# EasyEDA Pro project 小智ai语音聊天玩具，智能聊天，esp32-s3拓展板42pin.eprj

# Schematic Schematic1
Board Name: Schematic1; Create Date: 2025-03-19; Page Name: P1; Project Name: 小智ai语音聊天玩具，智能语音聊天，esp32-s3拓展板; Schematic Name: Schematic1; Update Date: 2025-03-21; Company: 嘉立创EDA; Page Size: A4; Version: V1.0
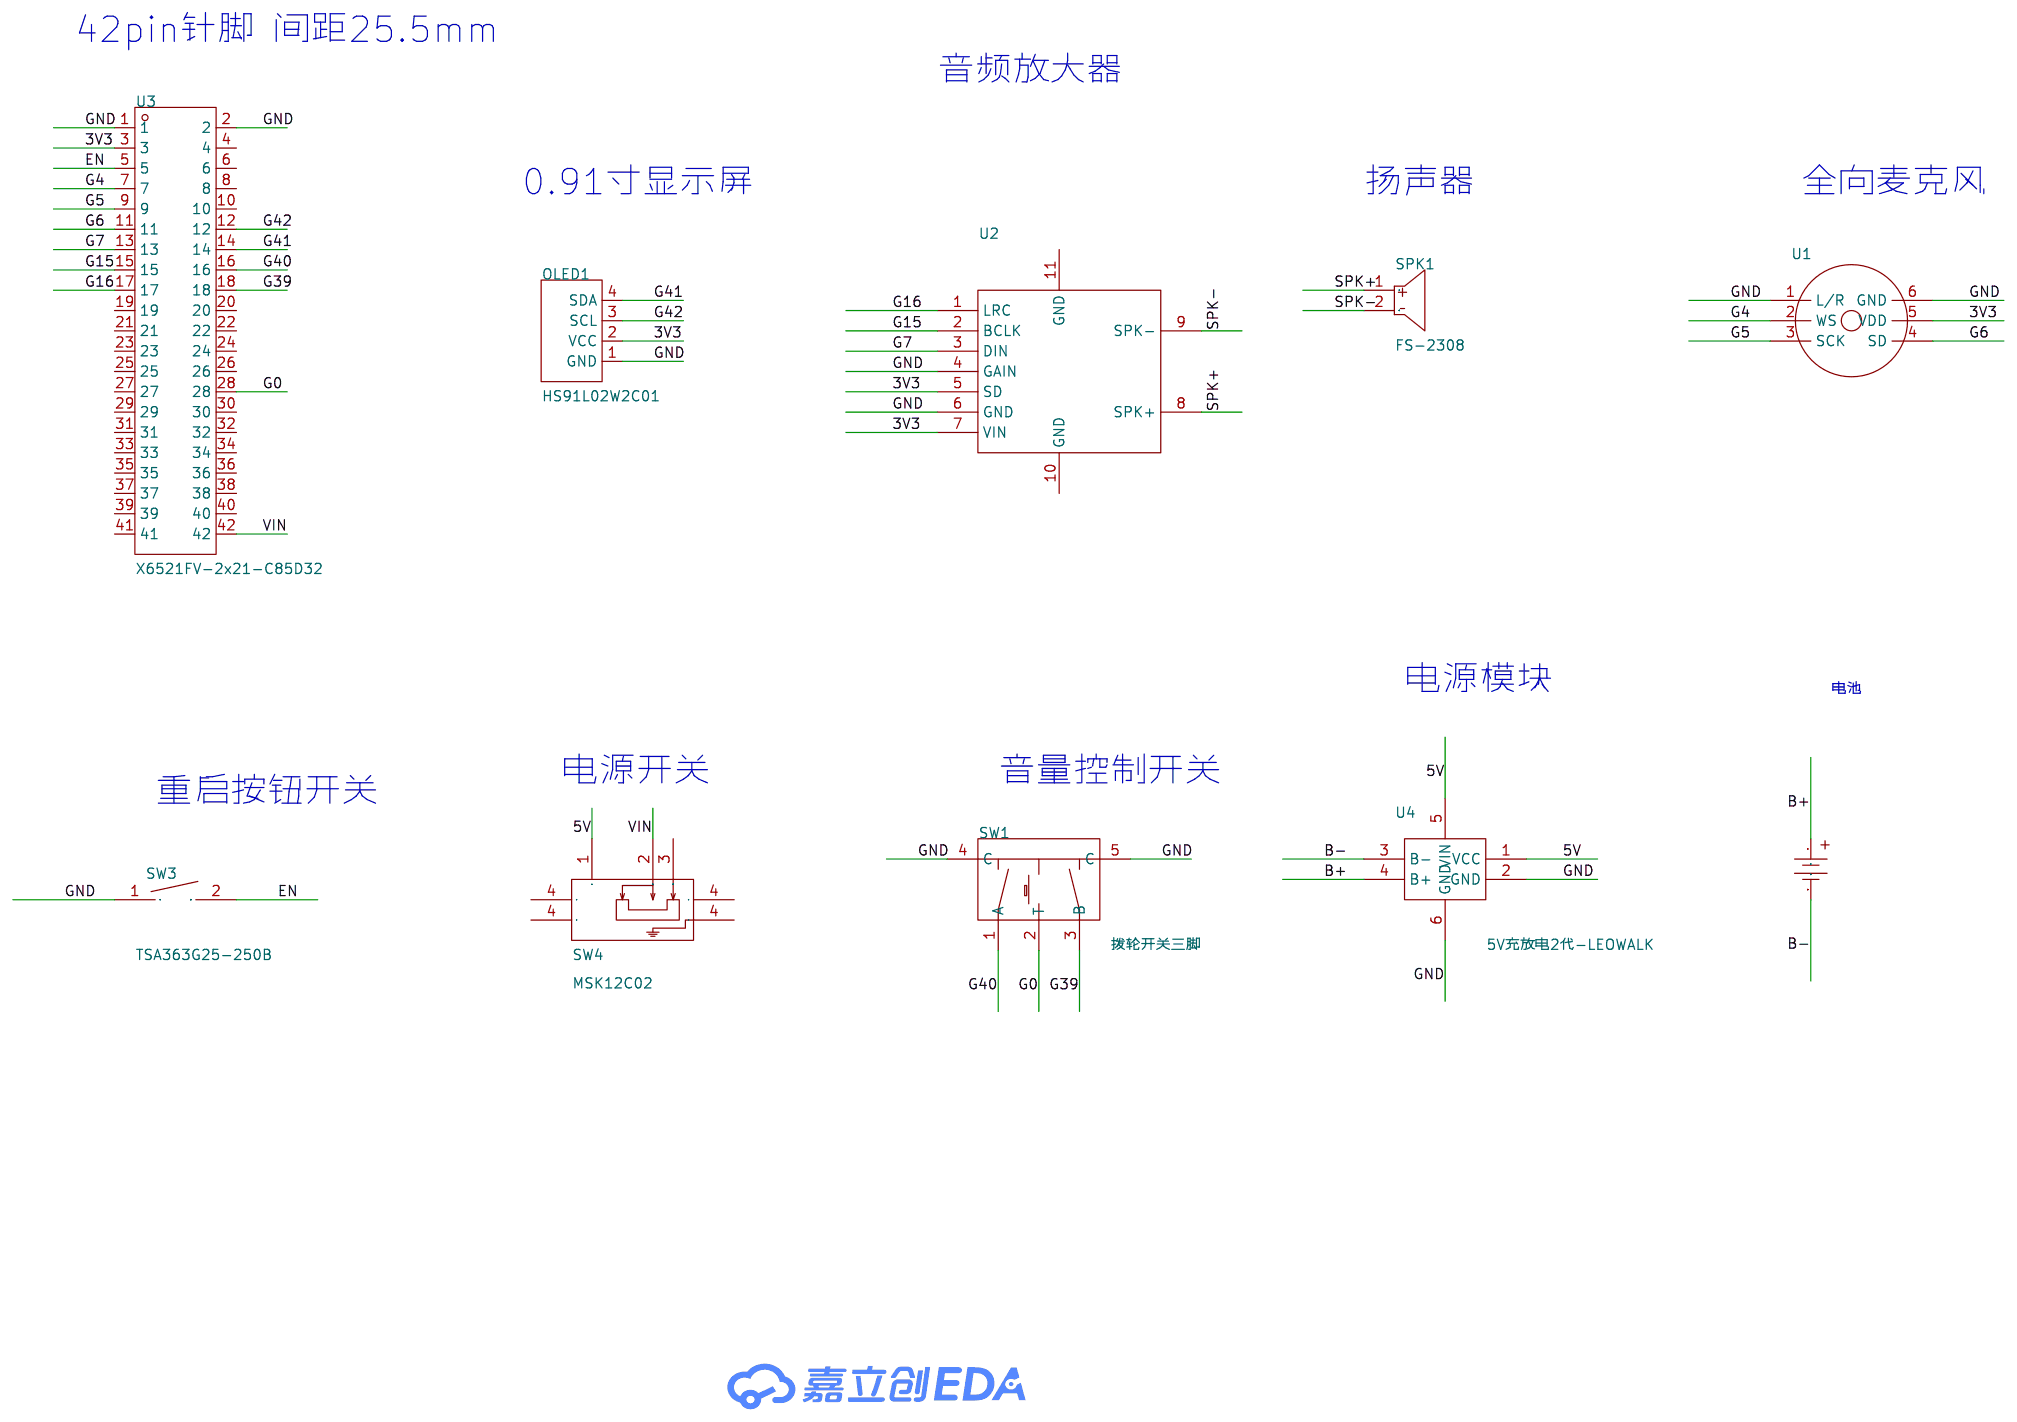
[diagram p0: schematic sheet]

## Parts
?#1  -  [电池焊盘]
OLED1  HS91L02W2C01  [OLED-TH_L38.0-W12.0_HS91L02W2C01]
SPK1  FS-2308  [BEEP-TH_BD23.2-P9.20-D1.0]
SW1  拨轮开关三脚
SW3  TSA363G25-250B  [SW-SMD_L6.1-W3.6-LS8.0]
SW4  MSK12C02  [SW-TH_MSK12C02_1]
U1  -  [INMP441_精确封装]
U2  -  [MAX98357]
U3  X6521FV-2x21-C85D32  [HDR-TH_42P-P2.54-V-F-R2-C21-S2.54]
U4  5V充放电2代-LEOWALK  [5V充放电-2代-LEOWALK]

## Library data of the parts
?#1 = 电池焊盘
OLED1 = HS91L02W2C01: 主控芯片:SSD1306;接口类型:I2C;尺寸(inch):0.91;像素分辨率:128x32;; Supplier: LCSC; Supplier Part: C5248081; Manufacturer: HS(汉昇); JLCPCB Part Class: 扩展库; LCSC Part Name: 0.91寸OLED显示屏白光IIC; Datasheet: https://atta.szlcsc.com/upload/public/pdf/source/20230727/C3E43C8E3DDA847F5681FEE7D95C153D.pdf; Main Control Chip: SSD1306; Interface Type: I2C; Size: 0.91; Pixel Resolution: 128x32; Operating Temperature: -40℃~+70℃
SPK1 = FS-2308: LCSC Part Name: 喇叭23MM-8.0H 8Ω1W 插针; Supplier Part: C482322; Manufacturer: FUET(福声科技); JLCPCB Part Class: Extended Part; Datasheet: https://atta.szlcsc.com/upload/public/pdf/source/20200113/C482322_D09CD61BAFBB8D4AD64070E01BFD18FF.pdf; Supplier: LCSC
SW1 = 拨轮开关三脚
SW3 = TSA363G25-250B: 触点电流:50mA;额定电压(DC):12V;电路结构:单刀单掷;按钮作用方向:顶部触动;致动器样式:矩形按钮;照明颜色:-;开关长度:6.05mm;开关宽度:3.6mm;开关高度:2.5mm;; LCSC Part Name: 3*6*2.5  白柄贴片  250gf; Supplier Part: C354943; Manufacturer: BRIGHT(博瑞泰); Supplier Footprint: SMD; JLCPCB Part Class: Extended Part; Datasheet: https://atta.szlcsc.com/upload/public/pdf/source/20190426/C354943_F8D02988919B0D3B4D493E3C3D798834.pdf; Supplier: LCSC; Contact Current: 50mA; Voltage Rating (DC): 12V; Circuit: 单刀单掷; Actuator Orientation: 顶部触动; Actuator Style: 矩形按钮; Switch Length: 6.05mm; Switch Width: 3.6mm; Switch Height: 2.5mm
SW4 = MSK12C023: LCSC Part Name: 两档侧拨贴片 7脚 拨动 白柄 柄长1.5mm,带定位柱; Supplier Part: C431540; Manufacturer: SHOU HAN(首韩); Supplier Footprint: SMD; JLCPCB Part Class: 扩展库; Datasheet: https://atta.szlcsc.com/upload/public/pdf/source/20190925/C431540_89155AEF0758B9AD1B2D805F83FB12E3.pdf; Supplier: LCSC
U1 = INMP441
U2 = MAX98357
U3 = X6521FV-2X21-C85D32: 间距:2.54mm;总孔位数:42;排数:2;插孔结构:2x21P;行距:2.54mm;安装类型:直插;圆孔/方孔:方孔;额定电流:3A;额定电压:250V;插孔方向:顶部;塑高:8.5mm;触头材质:黄铜;触头镀层:金;工作温度范围:-40℃~+105℃;焊接温度(最大值):260℃;; LCSC Part Name: 2.54mm 2x21P; Supplier Part: C2883994; Manufacturer: XKB Connectivity(中国星坤); Supplier Footprint: 插件,P=2.54mm; Datasheet: https://atta.szlcsc.com/upload/public/pdf/source/20211009/C636DBF0733662F7F428F4420CCBBD46.pdf; Supplier: LCSC; Pitch: 2.54mm; Number of Holes: 42; Number of Rows: 2; Holes Structure: 2x21P; Row Spacing: 2.54mm; Mounting Type: 直插; Circular Hole / Square Hole: 方孔; Current Rating (Max): 3A; Voltage Rating (Max): 250V; Holes Direction: 顶部; Insulation Height: 8.5mm; Contact Material: 黄铜; Contact Plating: 金; Operating Temperature Range: -40℃~+105℃; Welding Temperature (Max): 260℃
U4 = 5V充放电2代-LEOWALK: Manufacturer: TJC; Manufacturer Part: TJC3224K028_011; Supplier: TJC; Supplier Part: TJC3224K028_011; link: http://filedown.tjc1688.com/USARTHMI/pdf/K0.zip

## Nets
3V3: OLED1.2(VCC) U1.5(VDD) U2.5(SD) U2.7(VIN) U3.3
5V: SW4.1 U4.1(VCC) U4.5(VIN)
GND: OLED1.1(GND) SW1.4(C) SW1.5(C) SW3.1 U1.1(L/R) U1.6(GND) U2.4(GAIN) U2.6(GND) U3.1 U3.2 U4.2(GND) U4.6(GND)
VIN: SW4.2 U3.42
B+: ?#1.1 U4.4(B+)
B-: ?#1.2 U4.3(B-)
EN: SW3.2 U3.5
G0: SW1.2(T) U3.28
G4: U1.2(WS) U3.7
G5: U1.3(SCK) U3.9
G6: U1.4(SD) U3.11
G7: U2.3(DIN) U3.13
G15: U2.2(BCLK) U3.15
G16: U2.1(LRC) U3.17
G39: SW1.3(B) U3.18
G40: SW1.1(A) U3.16
G41: OLED1.4(SDA) U3.14
G42: OLED1.3(SCL) U3.12
SPK+: SPK1.1 U2.8(SPK+)
SPK-: SPK1.2 U2.9(SPK-)

Not connected (* = marked no-connect by the designer): SW4 3 4; U2 10(GND) 11(GND); U3 4 6 8 10 19 20 21 22 23 24 25 26 27 29 30 31 32 33 34 35 36 37 38 39 40 41

## Notes on the sheet
- 42pin针脚 间距25.5mm
- 音频放大器
- 0.91寸显示屏
- 扬声器
- 全向麦克风
- 电源模块
- 电池
- 电源开关
- 音量控制开关
- 重启按钮开关

# Board 小智ai方案1
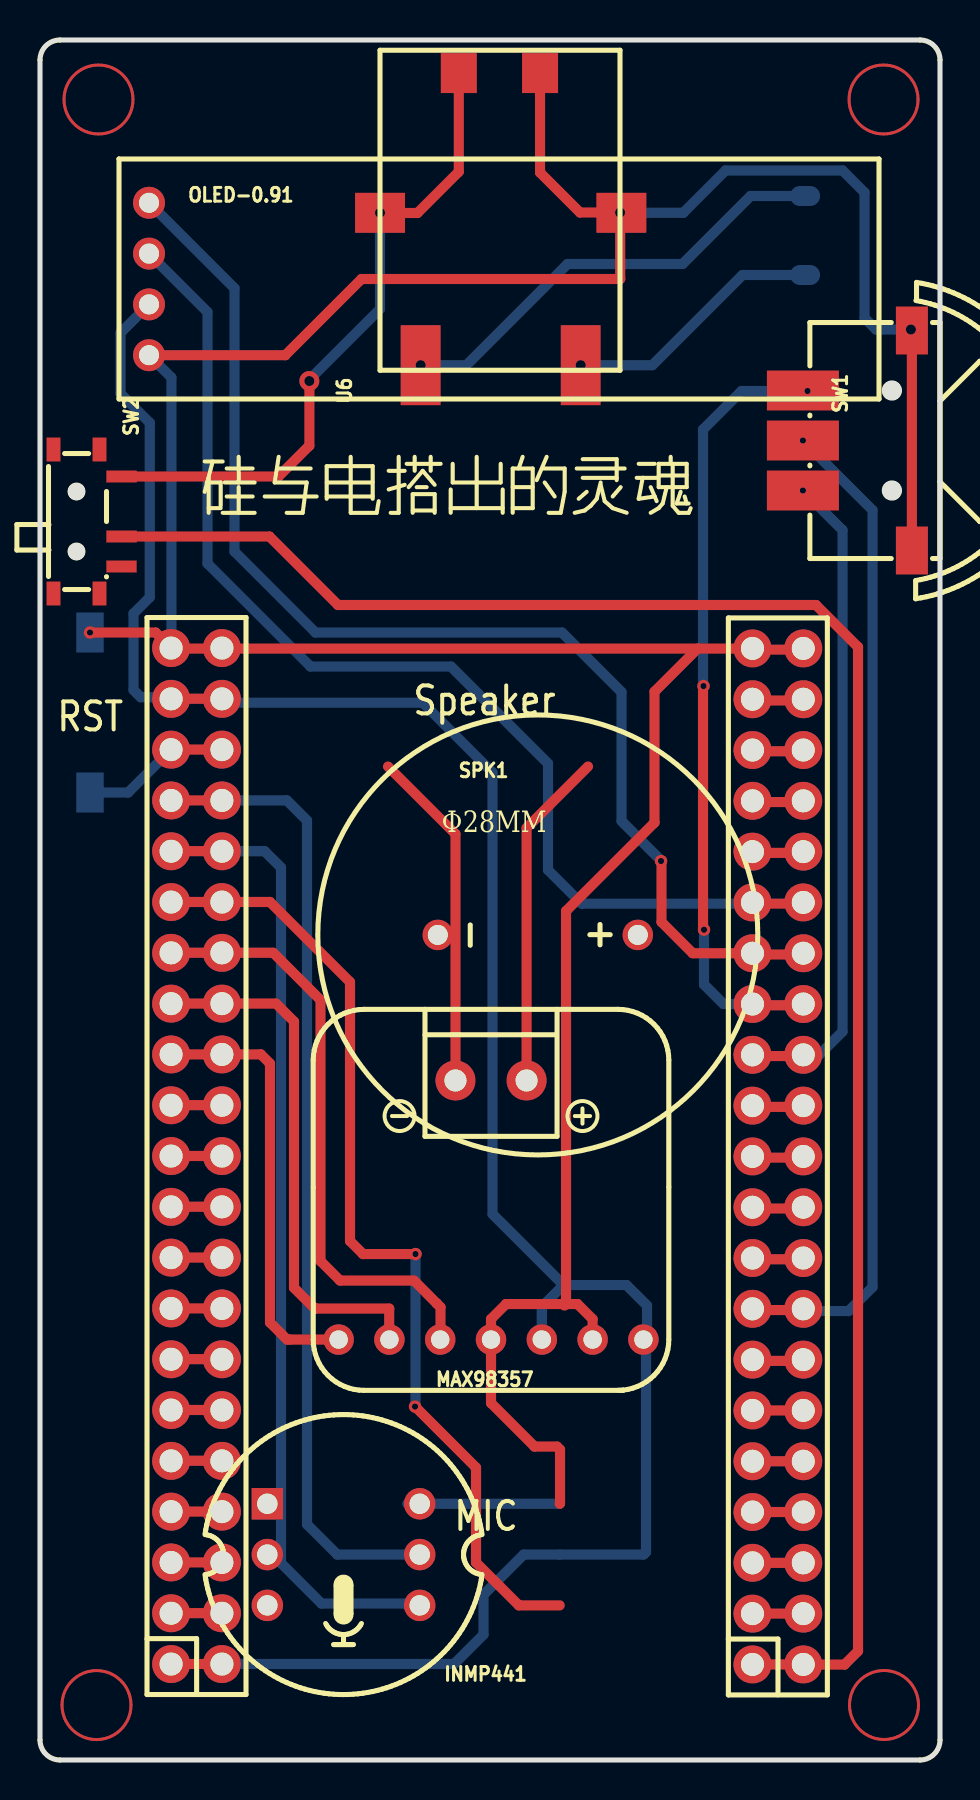
[diagram p1: board, top side]
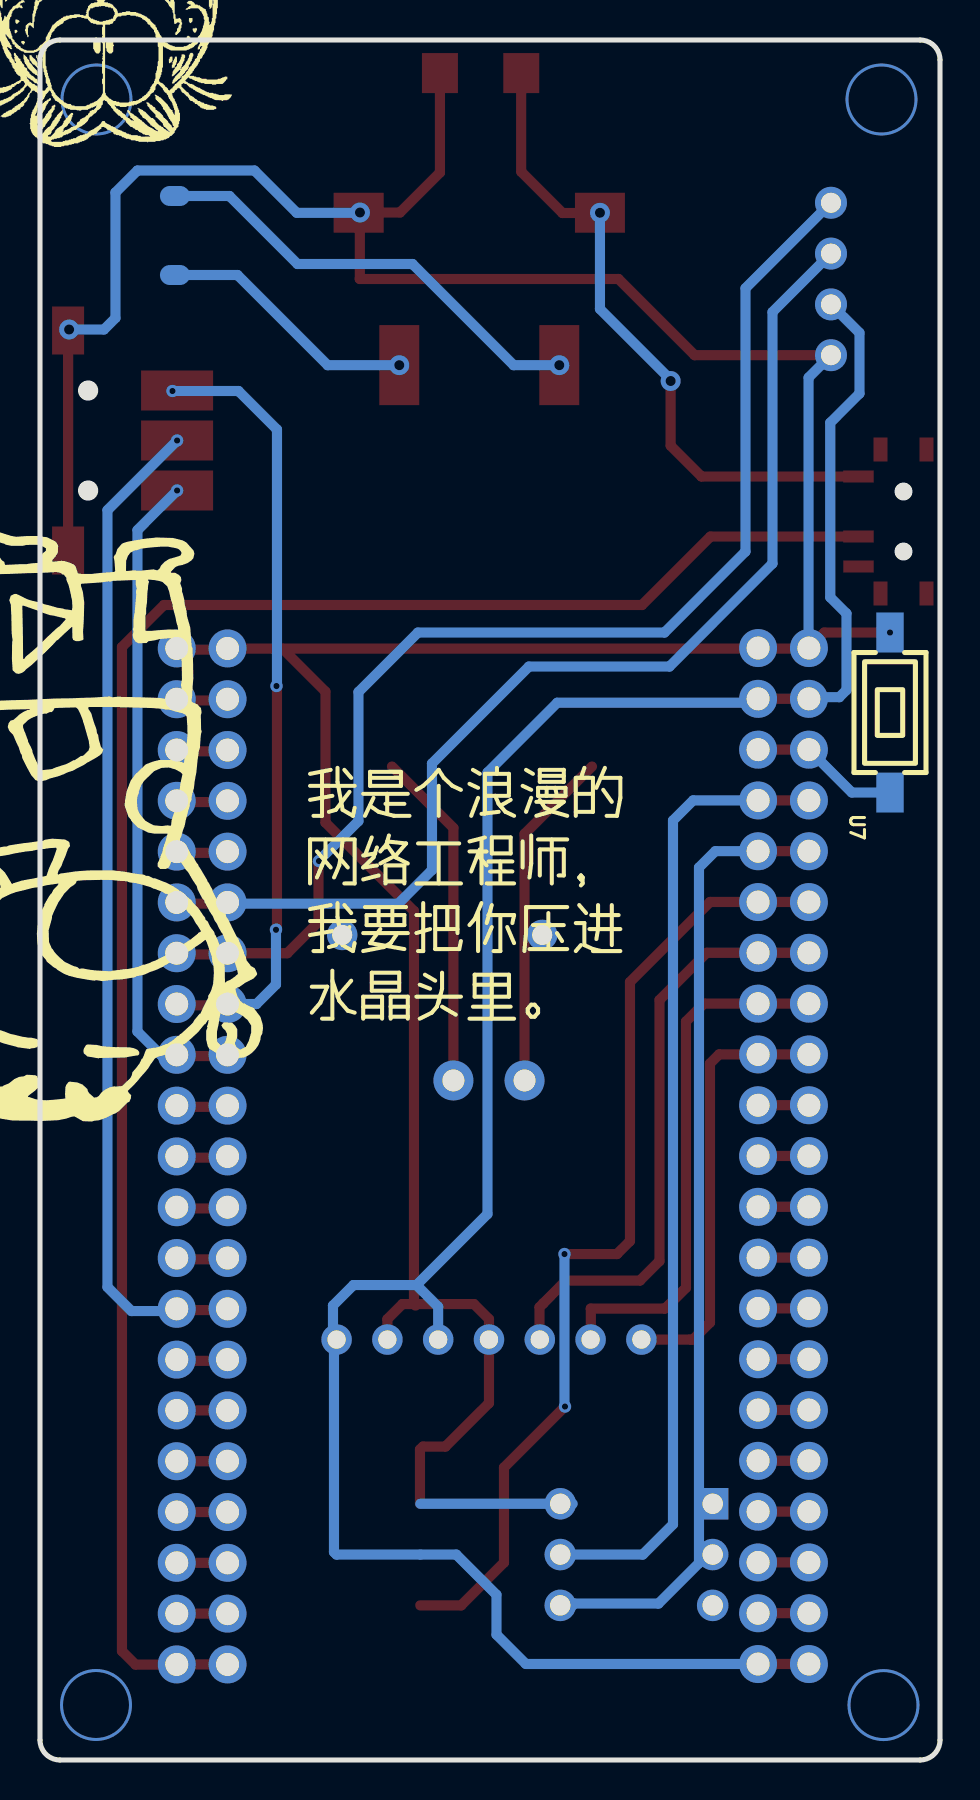
[diagram p2: board, bottom side, seen from below]

Outline 45 x 86 mm; copper layers: Top Layer, Bottom Layer. Coordinates in mm from the lower left corner of the outline.
Outline path: 0,85 0,1 arc(0.29,0.29) 1,0 44,0 arc(44.71,0.29) 45,1 45,85 arc(44.71,85.71) 44,86 1,86 arc(0.29,85.71) 0,85
Stack: Top Layer 0.035mm / Dielectric1 1.51mm FR4 er 4.5 / Bottom Layer 0.035mm

## Design rules (mm)
template: 自定义配置
spacing copperThickness1oz: track to track 0.102, other pairs 0.152 to 0.3
spacing copperThickness2oz (default): track to track 0.203, other pairs 0.152 to 0.3
track width copperThickness1oz: min 0.127, default 0.254, max 2.54
track width copperThickness2oz (default): min 0.203, default 0.254, max 2.54
differential pair differentialPair (default): width min 0.127, default 0.254, max 2.54; gap min 0.152, default 0.152
via viaSize (default): diameter min 0.5, default 0.61, max 10; hole min 0.3, default 0.305, max 6.3

## Placement (name value [footprint] x y rotation side)
INMP441  INMP441  [全向麦克风模块INMP441]  15.18 10.27 0 top
MAX98357  -  [MAX98357 I2S AMP MODULE]  22.55 21.02 90 top
OLED-0.91  HS91L02W2C01  [OLED-TH_L38.0-W12.0_HS91L02W2C01]  5.45 74.05 0 top
SPK1  FS-2308  [BEEP-TH_BD23.2-P9.20-D1.0]  22.4 49.67 270 top
SW1  -  [拨轮开关三脚]  42.59 65.97 270 top
SW2  MSK12C02  [SW-TH_MSK12C02]  2.38 61.92 270 top
U3  X6521FV-2x21-C85D32  [HDR-TH_42P-P2.54-V-F-R2-C21-S2.54]  36.89 30.18 90 top
U4  5V充放电2代-LEOWALK  [HDR-TH_42P-P2.54-V-F-R2-C21-S2.54]  7.83 30.2 90 top
U6  5V充放电2代-LEOWALK  [5V充放电-2代-LEOWALK]  21.7 77.74 90 top
U7  -  [SW-SMD_L6.1-W3.6-LS8.0]  2.5 52.37 90 bottom
U8  -  [电池焊盘]  39.78 73.37 180 bottom

## Footprints (pads in the part's own frame, mm; a bottom-side part is the same pattern mirrored in y, then rotated)
5V充放电-2代-LEOWALK
  rect 2x1.8 smd: 1(6.604,0.762) 2(6.604,-3.302)
  rect 4x2 smd: 3(-8.001,2.667) 4(-8.001,-5.334)
  rect 2x2.5 smd: 5(-0.381,4.699) 6(-0.381,-7.366)
BEEP-TH_BD23.2-P9.20-D1.0
  round 1.524 hole 1: 1(8.42,7.489) 2(8.42,-2.511)
HDR-TH_42P-P2.54-V-F-R2-C21-S2.54
  round 1.9 hole 1.15: 1(-25.4,1.27) 2(-22.86,1.27) 3(-20.32,1.27) 4(-17.78,1.27) 5(-15.24,1.27) 6(-12.7,1.27) 7(-10.16,1.27) 8(-7.62,1.27) 9(-5.08,1.27) 10(-2.54,1.27) 11(0,1.27) 12(2.54,1.27) 13(5.08,1.27) 14(7.62,1.27) 15(10.16,1.27) 16(12.7,1.27) 17(15.24,1.27) 18(17.78,1.27) 19(20.32,1.27) 20(22.86,1.27) 21(25.4,1.27) 22(25.4,-1.27) 23(22.86,-1.27) 24(20.32,-1.27) 25(17.78,-1.27) 26(15.24,-1.27) 27(12.7,-1.27) 28(10.16,-1.27) 29(7.62,-1.27) 30(5.08,-1.27) 31(2.54,-1.27) 32(0,-1.27) 33(-2.54,-1.27) 34(-5.08,-1.27) 35(-7.62,-1.27) 36(-10.16,-1.27) 37(-12.7,-1.27) 38(-15.24,-1.27) 39(-17.78,-1.27) 40(-20.32,-1.27) 41(-22.86,-1.27) 42(-25.4,-1.27)
MAX98357 I2S AMP MODULE
  round 1.524 hole 0.914: 1(0,7.62) 2(0,5.08) 3(0,2.54) 4(0,0) 5(0,-2.54) 6(0,-5.08) 7(0,-7.62)
  round 2 hole 1.1: 8(12.954,-1.778) 9(12.954,1.778)
OLED-TH_L38.0-W12.0_HS91L02W2C01
  round 1.6 hole 1: 1(0,-3.81) 2(0,-1.27) 3(0,1.27) 4(0,3.81)
SW-SMD_L6.1-W3.6-LS8.0
  rect 1.999x1.379 smd: 1(-4,0) 2(4,0)
SW-TH_MSK12C02
  rect 0.6x1.524 smd: 1(-2.25,1.7) 2(0.75,1.7) 3(2.25,1.7)
  rect 1.2x0.7 smd: 4(-3.6,0.6) 4(-3.6,-1.7) 4(3.6,0.6) 4(3.6,-1.7)
全向麦克风模块INMP441
  rect 1.575x1.575 hole 1.02: 1(-3.81,2.54)
  round 1.575 hole 1.02: 2(-3.81,0) 3(-3.81,-2.54) 4(3.81,-2.54) 5(3.81,0) 6(3.81,2.54)
拨轮开关三脚
  rect 2x3.6 smd: 1(-2.5,-4.45) 2(0,-4.45) 3(2.5,-4.45)
  rect 2.4x1.6 smd: 4(-5.5,1) 5(5.5,1)
电池焊盘
  oval 1.5x1 smd: 1(1.524,4.826) 2(1.524,0.875)

## Nets
3V3: INMP441.5 MAX98357.5 MAX98357.7 OLED-0.91.2 U4.1 U4.20 U4.23 U4.42
GND: INMP441.1 INMP441.6 MAX98357.4 MAX98357.6 OLED-0.91.1 SW1.4 SW1.5 U3.21 U3.22 U4.21 U4.22 U6.2 U6.6 U7.2
V5IN: SW2.2 U3.1 U3.42
B+: U6.4 U8.2
B-: U6.3 U8.1
EN: U4.19 U4.24 U7.1
G0: SW1.2 U3.8 U3.35
G1: U3.20 U3.23
G2: U3.19 U3.24
G3: U4.7 U4.36
G4_WS: INMP441.2 U4.18 U4.25
G5_SCK: INMP441.3 U4.17 U4.26
G6_SD: INMP441.4 U4.16 U4.27
G7_DIN: MAX98357.3 U4.15 U4.28
G8: U4.10 U4.33
G9: U4.5 U4.38
G10: U4.4 U4.39
G11: U4.3 U4.40
G12: U4.2 U4.41
G13: U3.2 U3.41
G14: U3.3 U3.40
G15_BCLK: MAX98357.2 U4.14 U4.29
G16_LRC: MAX98357.1 U4.13 U4.30
G17: U4.12 U4.31
G18: U4.11 U4.32
G19: U4.9 U4.34
G20: U4.8 U4.35
G21: U3.4 U3.39
G35: U3.9 U3.34
G36: U3.10 U3.33
G37: U3.11 U3.32
G38: U3.12 U3.31
G39: SW1.3 U3.13 U3.30
G40: SW1.1 U3.14 U3.29
G41_SDA: OLED-0.91.4 U3.15 U3.28
G42_SCK: OLED-0.91.3 U3.16 U3.27
G45: U3.7 U3.36
G46: U4.6 U4.37
G47: U3.5 U3.38
G48: U3.6 U3.37
RX0: U3.17 U3.26
TX0: U3.18 U3.25
$1N45227: MAX98357.8 SPK1.1
$1N45229: MAX98357.9 SPK1.2

Pads without a net: SW2 1 3 4; U6 1 5

## Via types
v1: diameter 1, hole 0.5, Top Layer to Bottom Layer, 6 vias
v2: diameter 3.6, hole 3.3, Top Layer to Bottom Layer, 4 vias
v3: diameter 0.62, hole 0.31, Top Layer to Bottom Layer, 9 vias

## Routing (per net, layer and track width the routed paths; a pad name or vN(x,y) marks a point on that pad's centre or on a via; arc(x,y) is an arc through that point)
3V3: length 115.3
  Top Layer w0.508: 6.56,53.06 9.01,53.06 9.05,53.1 ; 6.56,4.8 9.1,4.8
  Bottom Layer w0.508: 8.82,52.86 19.14,52.86 22.63,49.37 22.63,27.3 26.18,23.75 ; 9.1,4.8 20.71,4.8 22.18,6.27 22.18,8.26 24.18,10.27 30.18,10.27 30.3,10.4 30.3,20.97 30.45,21.12 ; 26.18,23.75 25.09,22.66 MAX98357.5 ; 26.18,23.75 29.33,23.75 30.35,22.72 30.35,21.2 MAX98357.7 ; 6.56,53.06 6.48,53.14 5.03,53.14 4.68,53.5 4.68,57.32 5.49,58.14 5.49,66.86 4.03,68.32 4.03,71.36 5.45,72.78
GND: length 184.6
  Top Layer w0.508: OLED-0.91.1 12.27,70.24 16.08,74.05 29.01,74.05 29.01,77.38 29.03,77.4 ; 6.57,55.57 9.08,55.57 ; 9.08,55.57 8.82,55.57 ; 9.08,55.57 35.65,55.57 35.68,55.6 ; 25.99,12.81 26,12.83 26,15.52 25.85,15.67 24.73,15.67 22.55,17.85 MAX98357.4 22.55,22.05 23.3,22.8 26.88,22.8 27.63,22.04 MAX98357.6 ; 26.23,22.72 26.3,22.8 26.3,42.45 30.73,46.87 30.73,53.42 32.89,55.58 ; 35.68,55.52 38.2,55.52 37.94,55.52 ; SW1.4 SW1.5 ; 6.56,55.6 5.78,56.37 v3(2.5,56.37) ; U6.2 25,79.37 27,77.38 ; 27,77.37 v1(29,77.37)
  Bottom Layer w0.508: OLED-0.91.1 6.57,69.12 6.57,55.57 ; 18.37,12.81 25.99,12.81 ; U6.6 32.16,77.36 34.28,79.48 40.13,79.48 41.23,78.38 41.23,72.1 41.8,71.52 v1(43.54,71.52) SW1.4
(no net): length 9.7
  Top Layer w0.508: v1(17,77.36) 17.01,77.35 18.88,77.35 20.94,79.41 U6.1
  vias: v1(13.47,68.95) v2(2.82,2.75) v2(2.92,83.03) v2(42.18,83.03) v2(42.2,2.75)
B+: length 13.1
  Bottom Layer w0.508: U8.2 35.13,74.25 30.62,69.74 v1(27.03,69.74)
B-: length 22.7
  Bottom Layer w0.508: U8.1 35.53,78.2 32.13,74.8 26.38,74.8 21.32,69.74 v1(19.03,69.74)
EN: length 7.5
  Top Layer w0.508: 6.56,50.52 9.1,50.52
  Bottom Layer w0.508: 6.56,50.52 4.41,48.37 U7.1
G0: length 50.2
  Top Layer w0.508: 35.66,22.5 38.2,22.5
  Bottom Layer w0.508: v3(38.14,65.97) 41.63,62.49 41.63,23.65 40.43,22.45 38.33,22.45 38.25,22.52
G6_SD: length 48.9
  Top Layer w0.508: 6.56,42.9 11.5,42.9 15.5,38.9 15.5,25.95 16.15,25.3 v3(18.78,25.3) ; 25.99,7.73 23.94,7.73 21.8,9.87 21.8,14.62 v3(18.75,17.67)
  Bottom Layer w0.508: v3(18.75,17.67) 18.78,17.7 v3(18.78,25.3)
G39: length 32.9
  Top Layer w0.508: 35.66,35.2 38.2,35.2
  Bottom Layer w0.508: v3(38.14,63.47) 40.13,61.49 40.13,36.42 38.96,35.26 U3.30
G40: length 39.2
  Top Layer w0.508: v3(33.18,53.7) 33.15,53.67 33.15,41.56 ; 35.66,37.74 38.2,37.74
  Bottom Layer w0.508: 33.15,53.67 33.15,66.52 35.08,68.45 v3(38.38,68.45) 38.4,68.47 ; 33.15,41.56 v3(33.2,41.51) 33.2,38.77 34.18,37.8 U3.14
G41_SDA: length 61.6
  Top Layer w0.508: 31.08,44.95 31.08,41.9 32.63,40.34 U3.15 ; 35.66,40.28 38.17,40.28 38.23,40.22
  Bottom Layer w0.508: OLED-0.91.4 9.73,73.59 9.73,60.42 13.78,56.37 26.1,56.37 29.08,53.4 29.08,46.95 31.08,44.95
  vias: v3(31.05,44.95)
V5IN: length 95
  Top Layer w0.508: 3.94,61.17 11.48,61.17 14.9,57.75 38.8,57.75 40.9,55.65 40.9,5.45 40.23,4.77 38.33,4.77 38.2,4.65 ; U3.1 U3.42
G1: length 2.5
  Top Layer w0.508: 35.66,52.98 38.2,52.98
G2: length 2.6
  Top Layer w0.508: 35.66,50.44 38.19,50.44 38.23,50.4
G3: length 2.5
  Top Layer w0.508: 6.56,20.04 9.1,20.04
G4_WS: length 48
  Top Layer w0.508: 6.56,47.98 9.1,47.98
  Bottom Layer w0.508: 9.1,47.98 12.34,47.98 13.35,46.97 13.35,11.78 14.86,10.27 18.37,10.27
G5_SCK: length 47.8
  Top Layer w0.508: 6.56,45.44 9.1,45.44
  Bottom Layer w0.508: 9.1,45.44 11.23,45.44 12.05,44.62 12.05,9.85 14.08,7.82 18.28,7.82 18.37,7.73
G7_DIN: length 30.3
  Top Layer w0.508: 6.56,40.36 9.1,40.36 ; 8.9,40.36 11.66,40.36 14.03,38 14.03,24.95 15,23.97 18.7,23.97 19.84,22.82 ; 19.84,22.82 19.83,22.85 ; 19.84,22.82 20.03,22.64 20.03,21.04 MAX98357.3 ; 19.83,21.04 19.81,21.02
G8: length 2.5
  Top Layer w0.508: 6.56,27.66 9.1,27.66
G9: length 2.5
  Top Layer w0.508: 6.56,14.96 9.1,14.96
G10: length 2.5
  Top Layer w0.508: 6.56,12.42 9.1,12.42
G11: length 2.5
  Top Layer w0.508: 6.56,9.88 8.96,9.88 9.03,9.95
G12: length 2.5
  Top Layer w0.508: 6.56,7.34 9.1,7.34
G13: length 2.5
  Top Layer w0.508: U3.2 U3.41
G14: length 2.5
  Top Layer w0.508: U3.3 U3.40
G15_BCLK: length 26.6
  Top Layer w0.508: 6.56,37.82 9.1,37.82 ; 9.17,37.82 11.8,37.82 12.7,36.92 12.7,23.61 13.74,22.57 ; 13.76,22.6 13.79,22.57 17.46,22.57 17.46,21.03 17.47,21.02 ; 17.6,21.08 17.55,21.02
G16_LRC: length 21.9
  Top Layer w0.508: 6.56,35.28 11.04,35.28 11.5,34.82 11.5,21.87 12.35,21.02 MAX98357.1
G17: length 2.5
  Top Layer w0.508: 6.56,32.74 9.1,32.74
G18: length 2.5
  Top Layer w0.508: 6.56,30.2 9.1,30.2
G19: length 2.5
  Top Layer w0.508: 6.56,25.12 9.1,25.12
G20: length 2.5
  Top Layer w0.508: 6.56,22.58 9.1,22.58
G21: length 2.6
  Top Layer w0.508: U3.4 38.08,12.4 38.15,12.32
G35: length 2.5
  Top Layer w0.508: 35.66,25.04 38.2,25.04
G36: length 2.5
  Top Layer w0.508: 35.66,27.58 38.2,27.58
G37: length 2.6
  Top Layer w0.508: 35.66,30.12 38.18,30.12 38.2,30.1
G38: length 2.6
  Top Layer w0.508: 35.66,32.66 38.12,32.66 38.2,32.57
G42_SCK: length 56.7
  Top Layer w0.508: 35.66,42.82 38.2,42.82
  Bottom Layer w0.508: OLED-0.91.3 8.38,72.4 8.38,59.82 13.53,54.67 20.55,54.67 25.4,49.82 25.4,44.5 27.08,42.82 35.66,42.82
G45: length 2.5
  Top Layer w0.508: 35.66,19.96 38.2,19.96
G46: length 2.5
  Top Layer w0.508: 6.56,17.5 9.1,17.5
G47: length 2.6
  Top Layer w0.508: U3.5 38.21,14.94 38.23,14.92
G48: length 2.6
  Top Layer w0.508: U3.6 38.15,17.48 38.18,17.45
RX0: length 2.5
  Top Layer w0.508: 35.66,45.36 38.2,45.36
TX0: length 2.5
  Top Layer w0.508: 35.66,47.9 38.2,47.9
$1N45227: length 17
  Top Layer w0.508: MAX98357.8 24.33,46.6 27.4,49.67
$1N45229: length 17.1
  Top Layer w0.508: 17.4,49.67 20.77,46.3 MAX98357.9

## Text on the board
Bottom Silkscreen Layer: 我是个浪漫的 / 网络工程师， / 我要把你压进 / 水晶头里。
Top Silkscreen Layer: RST | Speaker | MIC | 硅与电搭出的灵魂 | Φ28MM
